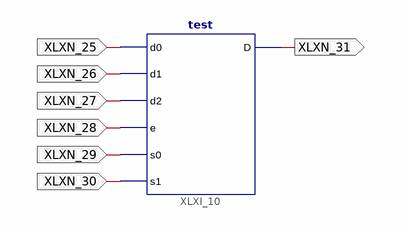
[diagram p0: schematic sheet 1]
// Xilinx ISE schematic multiplexer.sch (artix7) as structural Verilog: 1 symbols, 7 ports
module multiplexer (
  input  XLXN_25,
  input  XLXN_26,
  input  XLXN_27,
  input  XLXN_28,
  input  XLXN_29,
  input  XLXN_30,
  output XLXN_31
);

  test XLXI_10 (.d0(XLXN_25), .d1(XLXN_26), .d2(XLXN_27), .e(XLXN_28), .s0(XLXN_29), .s1(XLXN_30), .D(XLXN_31));
endmodule
